# EAGLE design drum_circuits (EAGLE 7.6.0)
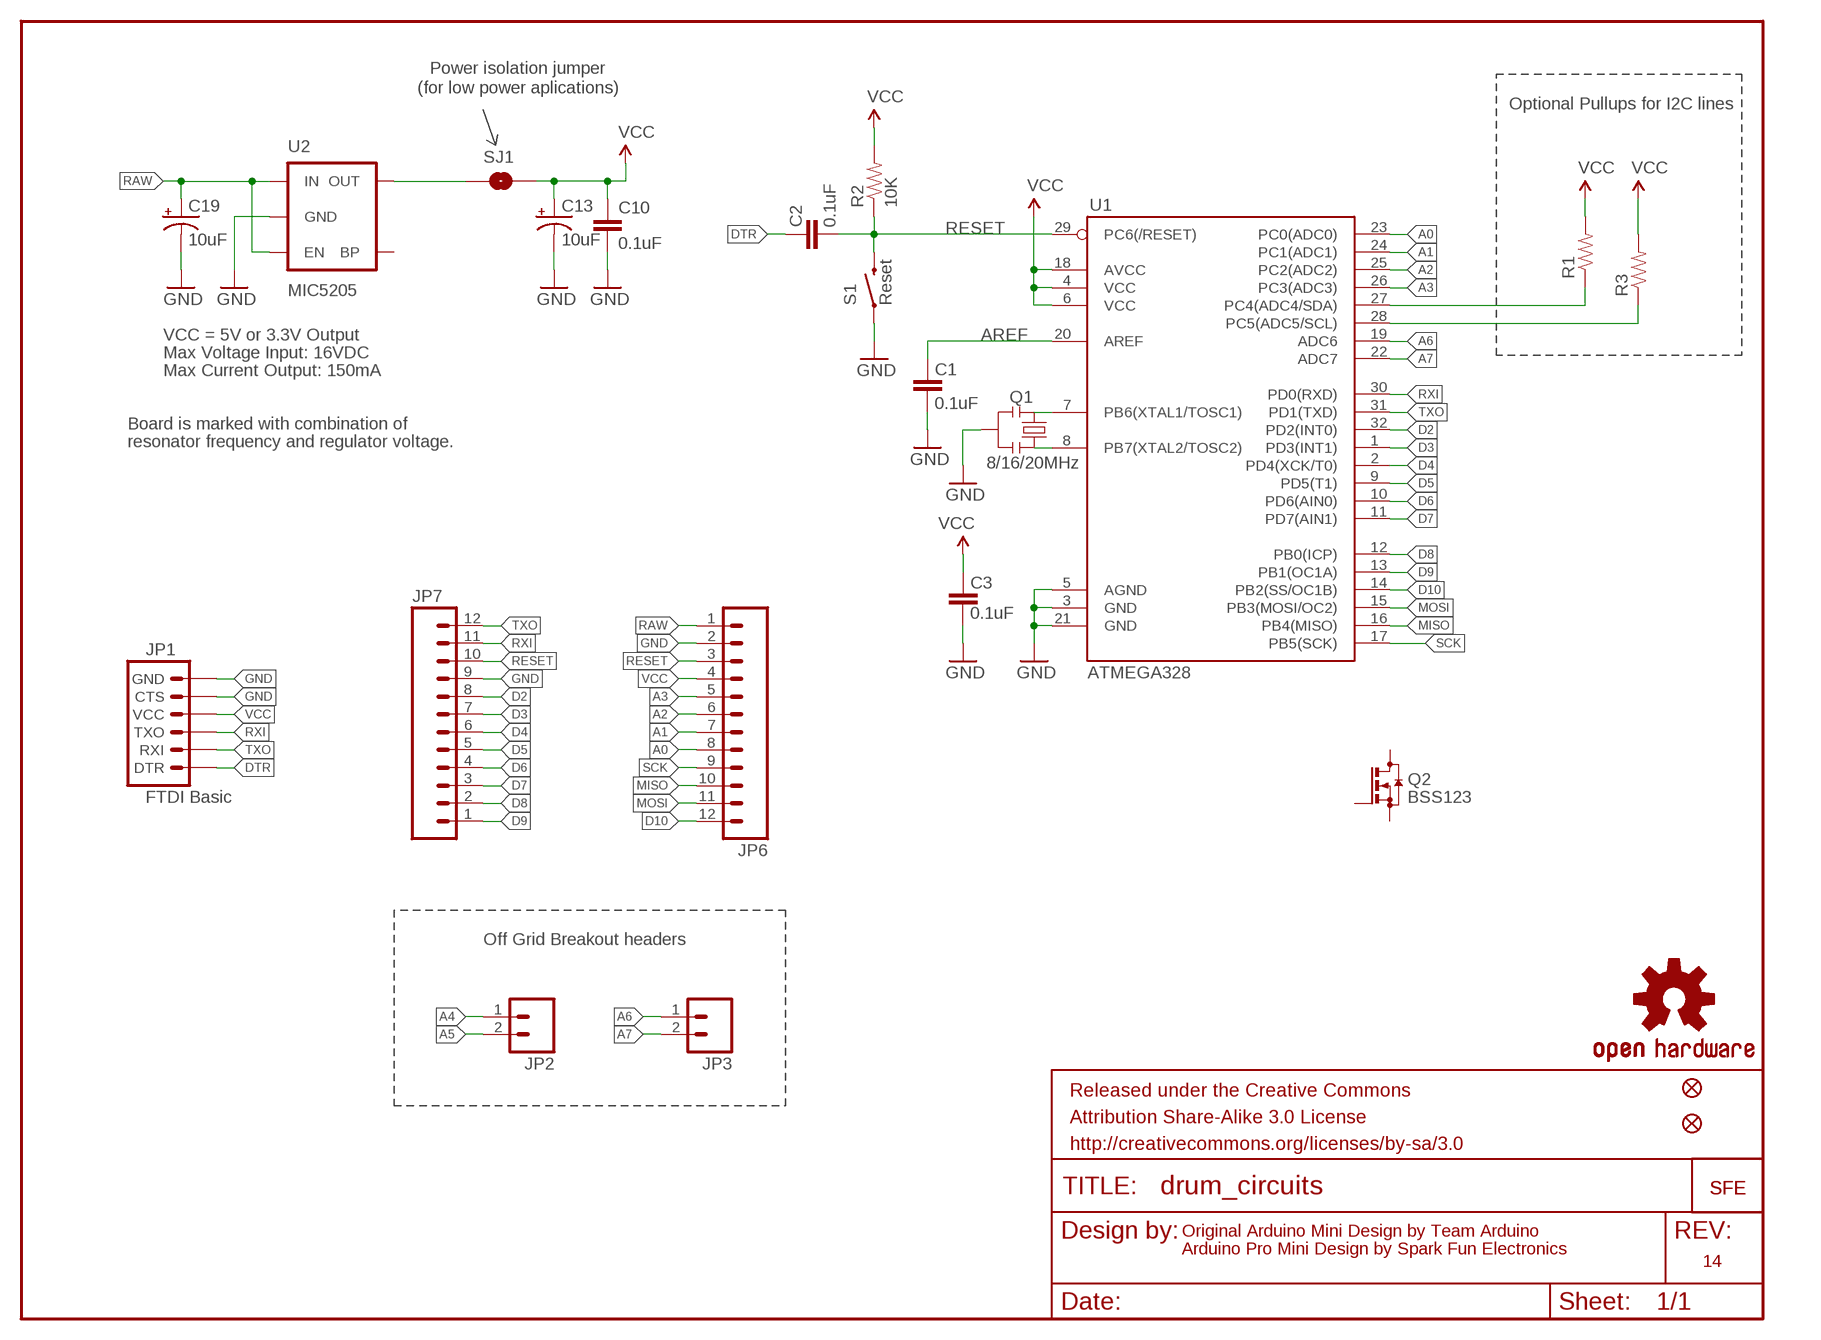
[diagram p0: schematic, sheet 1]

## Parts
C1  0.1uF  CAP0603-CAP  [0603-CAP]
C2  0.1uF  CAP0603-CAP  [0603-CAP]
C3  0.1uF  CAP0603-CAP  [0603-CAP]
C10  0.1uF  CAP0603-CAP  [0603-CAP]
C13  10uF  CAP_POL1206  [EIA3216]
C19  10uF  CAP_POL1206  [EIA3216]
FRAME1  FRAME-LETTER  [CREATIVE_COMMONS]
JP1  FTDI Basic  ARDUINO_SERIAL_PROGRAMPTH  [1X06]
JP2  M02PTH  [1X02]
JP3  M02PTH  [1X02]
JP5  FIDUCIALUFIDUCIAL  [MICRO-FIDUCIAL]
JP6  M12PTH  [1X12]
JP7  M12PTH  [1X12]
JP8  FIDUCIALUFIDUCIAL  [MICRO-FIDUCIAL]
Q1  8/16/20MHz  RESONATOR1:1  [RESONATOR-SMD-1:1]
Q2  BSS123  [SOT23]
R1  RESISTOR0603-RES  [0603-RES]
R2  10K  RESISTOR0603-RES  [0603-RES]
R3  RESISTOR0603-RES  [0603-RES]
S1  Reset  SWITCH-MOMENTARY-2SMD-ALT01  [TACTILE-SWITCH-SMD-ALT01]
SJ1  SOLDERJUMPERNC  [SJ_2S]
U1  ATMEGA328  ATMEGA168  [TQFP32-08]
U2  MIC5205  V_REG_LDOSMD  [SOT23-5]
U$1  LOGO-SFESK  [SFE-LOGO-FLAME]
U$3  OSHW-LOGOS  [OSHW-LOGO-S]
U$11  LOGO-SFENEW  [SFE-NEW-WEBLOGO]

## Nets
A0: JP6.8 U1.23(PC0(ADC0))
A1: JP6.7 U1.24(PC1(ADC1))
A2: JP6.6 U1.25(PC2(ADC2))
A3: JP6.5 U1.26(PC3(ADC3))
A4: JP2.1 R1.1 U1.27(PC4(ADC4/SDA))
A5: JP2.2 R3.1 U1.28(PC5(ADC5/SCL))
A6: JP3.1 U1.19(ADC6)
A7: JP3.2 U1.22(ADC7)
AREF: C1.2 U1.20(AREF)
D2: JP7.8 U1.32(PD2(INT0))
D3: JP7.7 U1.1(PD3(INT1))
D4: JP7.6 U1.2(PD4(XCK/T0))
D5: JP7.5 U1.9(PD5(T1))
D6: JP7.4 U1.10(PD6(AIN0))
D7: JP7.3 U1.11(PD7(AIN1))
D8: JP7.2 U1.12(PB0(ICP))
D9: JP7.1 U1.13(PB1(OC1A))
D10: JP6.12 U1.14(PB2(SS/OC1B))
DTR: C2.2 JP1.1(DTR)
GND [vcc]: C1.1 C3.1 C10.2 C13.C(-) C19.C(-) JP1.5(CTS) JP1.6(GND) JP6.2 JP7.9 Q1.2 S1.1 S1.2 U1.3(GND) U1.5(AGND) U1.21(GND) U2.2(GND)
MISO: JP6.10 U1.16(PB4(MISO))
MOSI: JP6.11 U1.15(PB3(MOSI/OC2))
N$1: Q1.3 U1.8(PB7(XTAL2/TOSC2))
N$2: Q1.1 U1.7(PB6(XTAL1/TOSC1))
N$3: SJ1.1 U2.5(OUT)
RAW [vcc]: C19.A(+) JP6.1 U2.1(IN) U2.3(EN)
RESET: C2.1 JP6.3 JP7.10 R2.1 S1.3 S1.4 U1.29(PC6(/RESET))
RXI: JP1.3(TXO) JP7.11 U1.30(PD0(RXD))
SCK: JP6.9 U1.17(PB5(SCK))
TXO: JP1.2(RXI) JP7.12 U1.31(PD1(TXD))
VCC: C3.2 C10.1 C13.A(+) JP1.4(VCC) JP6.4 R1.2 R2.2 R3.2 SJ1.2 U1.4(VCC) U1.6(VCC) U1.18(AVCC)
Unconnected: Q2.1(G) Q2.2(S) Q2.3(D) U2.4(BP)

## Notes on the sheet
- Power isolation jumper
- (for low power aplications)
- Optional Pullups for I2C lines
- VCC = 5V or 3.3V Output
- Max Voltage Input: 16VDC
- Max Current Output: 150mA
- Board is marked with combination of
- resonator frequency and regulator voltage.
- Off Grid Breakout headers
- Original Arduino Mini Design by Team Arduino
- Arduino Pro Mini Design by Spark Fun Electronics
- 14

## Library data of the parts
C1-C3 C10 = SparkFun:CAP: Capacitor Standard 0603 ceramic capacitor, and 0.1" leaded capacitor.
C13 C19 = SparkFun:CAP_POL: Capacitor Polarized These are standard SMD and PTH capacitors. Normally 10uF, 47uF, and 100uF in electrolytic and tantalum varieties. Always verify the external diameter of the through hole cap, it varies with capacity, voltage, and manufacturer. The EIA devices should be standard.
FRAME1 = SparkFun-Aesthetics:FRAME-LETTER: Schematic Frame Standard 8.5x11 US Letter frame
JP1 = SparkFun:ARDUINO_SERIAL_PROGRAM
JP2 JP3 = SparkFun:M02: Header 2 Standard 2-pin 0.1" header. Use with straight break away headers (SKU : PRT-00116), right angle break away headers (PRT-00553), swiss pins (PRT-00743), machine pins (PRT-00117), and female headers (PRT-00115). Molex polarized connector foot print use with SKU : PRT-08233 with associated crimp pins and housings.
JP5 JP8 = SparkFun:FIDUCIAL: Fiducial Alignment Points Various fiducial points for machine vision alignment.
JP6 JP7 = SparkFun:M12: Header 12 Standard 12-pin 0.1" header. Use with straight break away headers (SKU : PRT-00116), right angle break away headers (PRT-00553), swiss pins (PRT-00743), machine pins (PRT-00117), and female headers (PRT-00115).
Q1 = Testing:RESONATOR: Resonator Small SMD resonator. This is the itty bitty 10/20MHz resonators with built in caps. CSTCE10M0G55 and CSTCE20M0V53. Footprint for SMD has been used in SFE production for years, and does work okay. 1:1 is an attempt to get larger fillets on the sides so it will be easier to inspect these solders in our AOI machine. The pads have been minimized to match the actual metal under the resonator. To see this relation, it includes an image import of the bottom side of the component. Imported to scale on layer 200.
Q2 = transistor-small-signal:BSS123: N-CHANNEL MOS FET
R1-R3 = SparkFun:RESISTOR: Resistor Basic schematic elements and footprints for 0603, 1206, and PTH resistors.
S1 = Testing:SWITCH-MOMENTARY-2: Various NO switches- pushbuttons, reed, etc
SJ1 = SparkFun-Passives:SOLDERJUMPER: Solder Jumper Standard SMD solder jumper. Used to automate production. Two varients : Normally Open and Normally Closed are the same, but have different paste layers. NC will have a large amount of paste and should jumper during reflow.
U1 = SparkFun:ATMEGA168
U2 = SparkFun:V_REG_LDO: Voltage Regulator LDO Standard 150mA LDO voltage regulator in SOT-23 layout. Micrel part MIC5205. BP (by-pass) pin is used to lower output noise with 470pF cap.
U$1 U$11 = SparkFun:LOGO-SFE: Spark Fun Electronics PCB Logo This is the standard Spark Fun Electronics PCB logo.
U$3 = SparkFun:OSHW-LOGO: Open Source Hardware Logo This logo indicates the piece of hardware it is found on incorporates a OSHW license and/or adheres to the definition of open source hardware found here: http://freedomdefined.org/OSHW

## Net classes
0 default: width 0.203 mm
1 vcc: width 0.254 mm

## Board
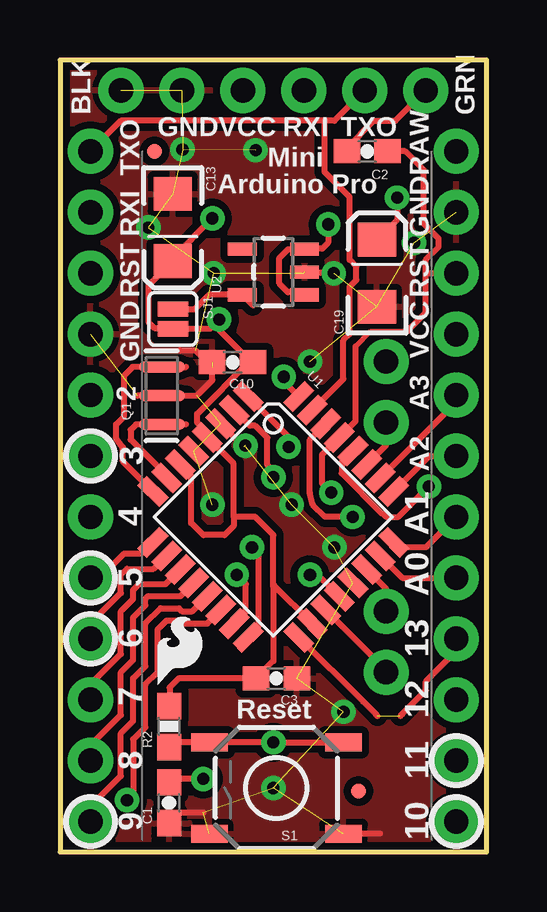
[diagram p1: board, top side]
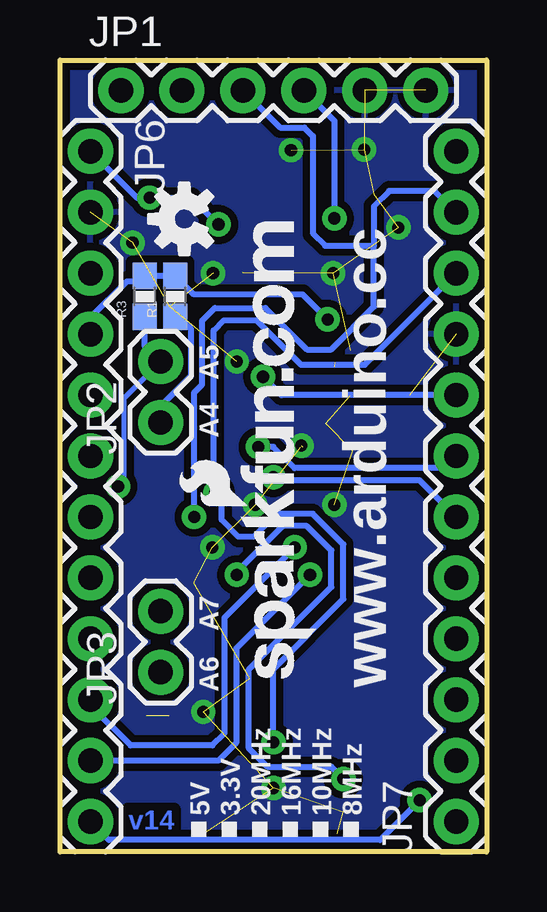
[diagram p2: board, bottom side, seen from below]

Size 17.78 x 33.02 mm. Coordinates in mm from the lower left corner, seen from the top.
Outline: 0,33.02 0,0 17.78,0 17.78,33.02 0,33.02
Copper layers (1*16): Top 0.035mm / dielectric 1.5mm / Bottom 0.035mm
Design rules "SparkFun-2-layer *": minimum track width 7mil, minimum drill 15mil, track to track 8mil, track to pad 8mil, pad to pad 8mil, via to via 8mil, smd to smd 8mil, copper to edge 8mil, drill to drill 8mil, minimum pad ring 12mil, minimum via ring 10mil, stop-mask expansion 4mil, vias tented up to drill 20mil, thermal gap 10mil

### Footprints (pad centres in the part's own frame; a part is rotated, then mirrored left to right if it is on the bottom)
0603-CAP = smd 1.1 x 1: 1 -0.85,0; 2 0.85,0
EIA3216 = smd 1.4 x 1.6: A 1.4,0; C -1.4,0
1X06 = drill 1.016 pad 1.88: 1 0,0; 2 2.54,0; 3 5.08,0; 4 7.62,0; 5 10.16,0; 6 12.7,0
1X02 = drill 1.016 pad 1.88: 1 0,0; 2 2.54,0
MICRO-FIDUCIAL = smd 0.635 x 0.635: 1 0,0
1X12 = drill 1.016 pad 1.88: 1 0,0; 2 2.54,0; 3 5.08,0; 4 7.62,0; 5 10.16,0; 6 12.7,0; 7 15.24,0; 8 17.78,0; 9 20.32,0; 10 22.86,0; 11 25.4,0; 12 27.94,0
RESONATOR-SMD-1:1 = smd 0.45 x 1.905: 1 -1.2,0; 2 0,0; 3 1.2,0
SOT23 = smd 1 x 1.4: 1 -0.95,-1.1; 2 0.95,-1.1; 3 0,1.1
0603-RES = smd 1.1 x 1: 1 -0.85,0; 2 0.85,0
TACTILE-SWITCH-SMD-ALT01 = smd 1.524 x 0.762: 1 -2.794,1.905; 2 2.794,1.905; 3 -2.794,-1.905; 4 2.794,-1.905
SJ_2S = smd 0.635 x 1.27: 1 -0.412,0; 2 0.412,0
TQFP32-08 = smd 1.27 x 0.559: 1 -4.293,2.8; 2 -4.293,2; 3 -4.293,1.2; 4 -4.293,0.4; 5 -4.293,-0.4; 6 -4.293,-1.2; 7 -4.293,-2; 8 -4.293,-2.8; 17 4.293,-2.8; 18 4.293,-2; 19 4.293,-1.2; 20 4.293,-0.4; 21 4.293,0.4; 22 4.293,1.2; 23 4.293,2; 24 4.293,2.8 | smd 0.559 x 1.27: 9 -2.8,-4.293; 10 -2,-4.293; 11 -1.2,-4.293; 12 -0.4,-4.293; 13 0.4,-4.293; 14 1.2,-4.293; 15 2,-4.293; 16 2.8,-4.293; 25 2.8,4.293; 26 2,4.293; 27 1.2,4.293; 28 0.4,4.293; 29 -0.4,4.293; 30 -1.2,4.293; 31 -2,4.293; 32 -2.8,4.293
SOT23-5 = smd 0.55 x 1.2: 1 -0.95,-1.3; 2 0,-1.3; 3 0.95,-1.3; 4 0.95,1.3; 5 -0.95,1.3

### Placement (x,y rotation side)
C1  4.55,2.06 90 top
C2  12.8,29.21 180 top
C3  9.02,7.24 180 top
C10  7.19,20.42 180 top
C13  4.7,26.04 270 top
C19  13.21,24.13 90 top
FRAME1  -15.98,-8.89 0 top  (outside the outline)
JP1  15.24,31.75 0 bottom
JP2  13.59,17.91 90 bottom
JP3  13.59,7.49 90 bottom
JP5  3.94,29.21 0 top
JP6  16.51,29.21 270 bottom
JP7  1.27,1.27 90 bottom
JP8  12.45,2.54 0 top
Q1  4.24,19.02 90 top
Q2  -34.29,-19.05 0 top  (outside the outline)
R1  12.98,23.16 90 bottom
R2  4.55,5.23 90 top
R3  14.25,23.16 90 bottom
S1  9.02,2.67 180 top
SJ1  4.7,22.23 270 top
U1  8.89,13.97 315 top
U2  8.89,24.18 90 top
U$1  4.06,6.99 0 top
U$3  12.6,26.39 90 bottom
U$11  7.11,7.24 90 bottom

### Tracks (layer width: path | path; a pad name or v marks a point on that pad's centre or on a via)
A0
  Top 0.254: 14.26,11.43 JP6.8 | U1.23 14.26,11.43 | 14.26,11.43
A1
  Top 0.254: JP6.7 15.24,12.7 13.97,12.7 13.9,12.77 U1.24
A2
  Top 0.254: U1.25 15.39,16.51 JP6.6
A3
  Top 0.254: 16.51,18.76 JP6.5 16.51,18.76 | U1.26 16.51,18.76
A4
  Top 0.254: 13.59,16.97 JP2.1 | U1.27 13.59,16.97 | 13.59,16.97
  Bottom 0.254: JP2.1 13.59,18.59 12.32,19.86 12.32,21.8 12.98,22.46 | R1.1 12.98,22.46 | 12.98,22.46 13.03,22.52
A5  (via drill 0.51)
  Top 0.254: v15.37,15.24 14.1,13.97 13.59,13.97 13.46,14.1 13.44,14.1 11.73,15.8 11.73,16.25 U1.28 | U1.28
  Bottom 0.203: v15.37,15.24 15.11,15.49 15.11,18.92 JP2.2
  Bottom 0.254: R3.1 14.25,21.11 JP2.2
A6
  Top 0.254: U1.19 13.59,7.57 JP3.1
A7
  Top 0.254: U1.22 13.59,10.97 JP3.2 | U1.22
AREF  (via drill 0.51)
  Top 0.254: 10.74,11.56 v10.41,11.56 10.74,11.56 | v5.97,3.05 4.69,3.05 C1.2 | U1.20 10.74,11.56
  Bottom 0.254: v10.41,11.56 10.41,11.68 8.51,13.59 7.49,13.59 6.48,12.57 6.48,11.05 9.91,7.62 9.91,4.32 9.14,3.56 6.48,3.56 v5.97,3.05
D2  (via drill 0.51)
  Top 0.254: U1.32 9.32,19.61 v9.32,19.81
  Bottom 0.254: JP7.8 8.56,19.05 v9.32,19.81
D3  (via drill 0.51)
  Top 0.254: 9.53,17.3 v9.53,16.89 9.53,17.3 | U1.1 9.53,17.3
  Bottom 0.254: JP7.7 1.78,16 8,16 8.89,16.89 v9.53,16.89
D4  (via drill 0.51)
  Top 0.254: v8.89,15.62 9.14,15.62 8.64,16.13 8.64,17.27 8.13,17.78 7.91,17.78 | U1.2 7.91,17.78 | 7.91,17.78
  Bottom 0.254: JP7.6 2.79,15.49 8.76,15.49 v8.89,15.62
D5
  Top 0.254: U1.9 3.41,12.45 2.67,12.45 1.65,11.43 JP7.5
D6
  Top 0.254: 1.27,9.18 JP7.4 1.27,9.53 2.54,10.79 2.54,11.56 2.79,11.81 3.9,11.81 | U1.10 3.9,11.81 | 3.9,11.81
D7
  Top 0.254: JP7.3 1.27,6.99 2.54,8.26 2.54,10.03 3.05,10.54 3.05,10.92 3.3,11.18 4.4,11.18 U1.11 | U1.11
D8
  Top 0.254: JP7.2 1.27,4.45 2.54,5.71 2.54,7.49 3.05,8 3.05,9.78 3.56,10.29 3.56,10.54 3.68,10.67 5.02,10.67 U1.12 | U1.12
D9
  Top 0.254: JP7.1 1.27,1.91 2.54,3.17 2.54,4.95 3.05,5.46 3.05,7.24 3.56,7.75 3.56,9.53 4.19,10.16 4.95,10.16 5.08,10.03 5.52,10.03 U1.13 | U1.13
D10  (via drill 0.51)
  Top 0.254: v2.79,2.16 3.05,2.41 3.05,4.7 3.56,5.21 3.56,6.99 4.06,7.49 4.06,9.27 4.45,9.65 4.83,9.65 4.95,9.53 6.14,9.53 U1.14 | U1.14
  Bottom 0.254: JP6.12 15.75,0.51 4.45,0.51 v2.79,2.16
DTR
  Top 0.254: JP1.1 13.97,30.48 13.08,30.48 11.95,29.35 C2.2
GND  (via drill 0.51)  (28 unrouted)
  Top 0.254: v11.4,24.13 10.16,24.13 | C1.1 4.99,1.65 5.97,1.65 | U1.3 7.67,16.89 7.75,16.89 | 13.32,0.76 S1.1 | 5.26,19.02 5.69,19.02 6.35,19.68 6.35,20.22 5.66,20.9 5.03,20.9 5,20.93 | C10.2
  other vias: 11.43,12.7 9.65,14.48 8.89,2.67 5.11,29.29 10.41,20.45 6.35,14.48 14.76,25.4 7.72,16.94 3.68,26.04 6.4,24.13 8.15,29.26 11.81,5.84
  pour Top (isolate 0.305): 0,33.02 17.78,33.02 17.78,0 0,0
  pour Bottom (isolate 0.305): 0,33.02 17.78,33.02 17.78,0 0,0
MISO  (via drill 0.51)
  Top 0.254: U1.16 8.26,9.38 8.26,12.45 v8,12.7
  Bottom 0.254: v8,12.7 10.92,9.78 10.92,4.95 11.43,4.45 14.83,4.45 16.51,6.12 JP6.10
MOSI  (via drill 0.51)
  Top 0.254: v7.37,11.56 7.75,11.18 7.75,10 U1.15 | U1.15
  Bottom 0.254: v7.37,11.56 10.44,8.48 10.44,4.55 11.18,3.81 JP6.11
N$1
  Top 0.254: U1.8 2.62,16.28 2.62,16.87 2.34,17.22 2.34,17.83 2.67,18.16 2.67,19.86 3.03,20.23 3.23,20.23
N$2
  Top 0.254: 4.16,15.87 U1.7 4.44,15.7 2.95,17.2 2.95,17.6 3.17,17.82 3.23,17.82
N$3
  Top 0.254: SJ1.1 5.62,22.64 6.21,23.23 U2.5 8.04,22.78
RAW  (via drill 0.51)
  Top 0.254: C19.A 14.05,26.37 v14.05,27.28 | U2.1 10.08,23.34 9.5,23.34 9.14,23.7 9.14,24.77 9.51,25.13 U2.3 10.21,25.15 10.92,25.15 11.18,25.4 v11.18,26.16
  Bottom 0.254: JP6.1 14.58,27.28 v14.05,27.28 12.29,27.28 v11.18,26.16
RESET  (via drill 0.51)
  Top 0.203: 14.48,21.72 12.95,21.72 12.32,21.08
  Top 0.254: 15.24,24.13 JP6.3 | 12.32,21.08 12.32,17.96 U1.29 | 15.24,24.13 15.24,22.48 14.48,21.72 | v11.3,14.99 10.92,15.37 10.92,16.57 U1.29 | 15.24,24.13 15.24,24.69 15.77,25.22 15.77,25.58 15.16,26.19 15.16,28.42 14.38,29.21 C2.1 | U1.29 | S1.3 v8.89,4.57 S1.4 4.74,4.57 R2.1
  Bottom 0.254: v8.89,4.57 8.89,7.62 5.97,10.54 5.97,12.83 7.24,14.1 8.76,14.1 9.72,13.14 10.35,13.14 11.05,13.84 11.05,14.73 v11.3,14.99 11.38,15.06 11.38,21.74 10.95,22.17 9.6,22.17 7.75,20.32 5.08,20.32 JP7.10
RXI  (via drill 0.51)
  Top 0.254: v12.19,13.97 11.05,13.97 10.54,14.48 10.41,14.99 10.41,17.19 U1.30 | U1.30
  Bottom 0.254: v12.19,13.97 12.19,19.15 11.86,19.48 11.86,22.15 11.33,22.68 9.22,22.68 7.49,20.95 6.48,20.95 4.7,22.73 4.7,25.27 | JP7.11 2.16,27.56 4.06,27.56 4.7,26.92 4.7,25.27 | 4.7,25.27 6.73,25.27 7.24,25.78 7.24,29.84 7.59,30.2 8.61,30.2 JP1.3
SCK  (1 unrouted)
  Top 0.254: JP6.9 16.51,8.38 15.24,7.11 15.24,6.73 14.26,5.75 14.19,5.68 | U1.17 12.62,6.28 13.15,5.75 13.22,5.68
TXO
  Top 0.254: JP7.12 2.54,30.48 11.02,30.48 | JP1.2 11.43,30.48 11.05,30.48 11.02,30.48 | 11.81,19.72 11.81,21.34 12.06,21.59 12.06,23.57 12.34,23.85 12.34,24.41 12.06,24.69 12.06,27.3 11.02,28.35 11.02,30.48 | U1.31 11.81,19.72 | 11.81,19.72
VCC  (via drill 0.51)
  Top 0.254: 8.89,11.14 8.94,11.1 8.89,11.05 | 8.89,11.05 8.89,11.14 | 8.89,11.14 8.89,13.21 8.13,13.97 7.24,13.97 | 7.24,13.97 7.24,13.59 6.86,13.21 5.97,13.21 5.46,13.72 5.46,15.7 U1.6 | 7.24,13.97 7.24,16.19 U1.4 | 8.89,11.05 8.89,7.96 C3.2 4.95,7.24 4.57,6.86 4.57,6.11 R2.2 | U1.4 | U1.18 8.89,11.14 | v6.35,26.42 4.7,24.77 C13.A 3.68,23.62 3.68,22.1 3.94,21.84 4.67,21.84 SJ1.2 6.24,21.81 v6.63,22.2 6.63,21.77 7.98,20.42 C10.1 7.87,20.42 5.71,18.26 5.71,17.91 6.14,17.49 U1.4 | 6.14,17.31 U1.4
  Bottom 0.254: JP6.4 16.51,22.28 14.99,23.8 14.46,23.8 R3.2 R1.2 12.21,23.24 7.67,23.24 v6.63,22.2 | v6.35,26.42 6.35,30.48 JP1.4

### Text on the board
Bottom: v14
tPlace: BLK | GRN | GND | VCC | RXI | TXO | Mini | TXO | RAW | Arduino Pro | RXI | GND | RST | RST | VCC | GND | 2 | A3 | 3 | A2 | 4 | A1 | 5 | A0 | 6 | 13 | 7 | Reset | 12 | 8 | 11 | 9 | 10
bPlace: A5 | A4 | A7 | www.arduino.cc | A6 | 8MHz | 10MHz | 16MHz | 20MHz | 3.3V | 5V
tValues: Valid combinations: | 168V / 3.3V Reg / 8MHz | 168 / 5V Reg / 16MHz | 168 / 5V Reg / 20MHz | Mark back accordingly | Arduino Pro Mini
tDocu: Original Arduino Mini Design by Team Arduino / Arduino Pro Mini Design by SparkFun Electronics / Revised by Pete Lewis